# EAGLE schematic wireless_thermometer (EAGLE 9.3.2)
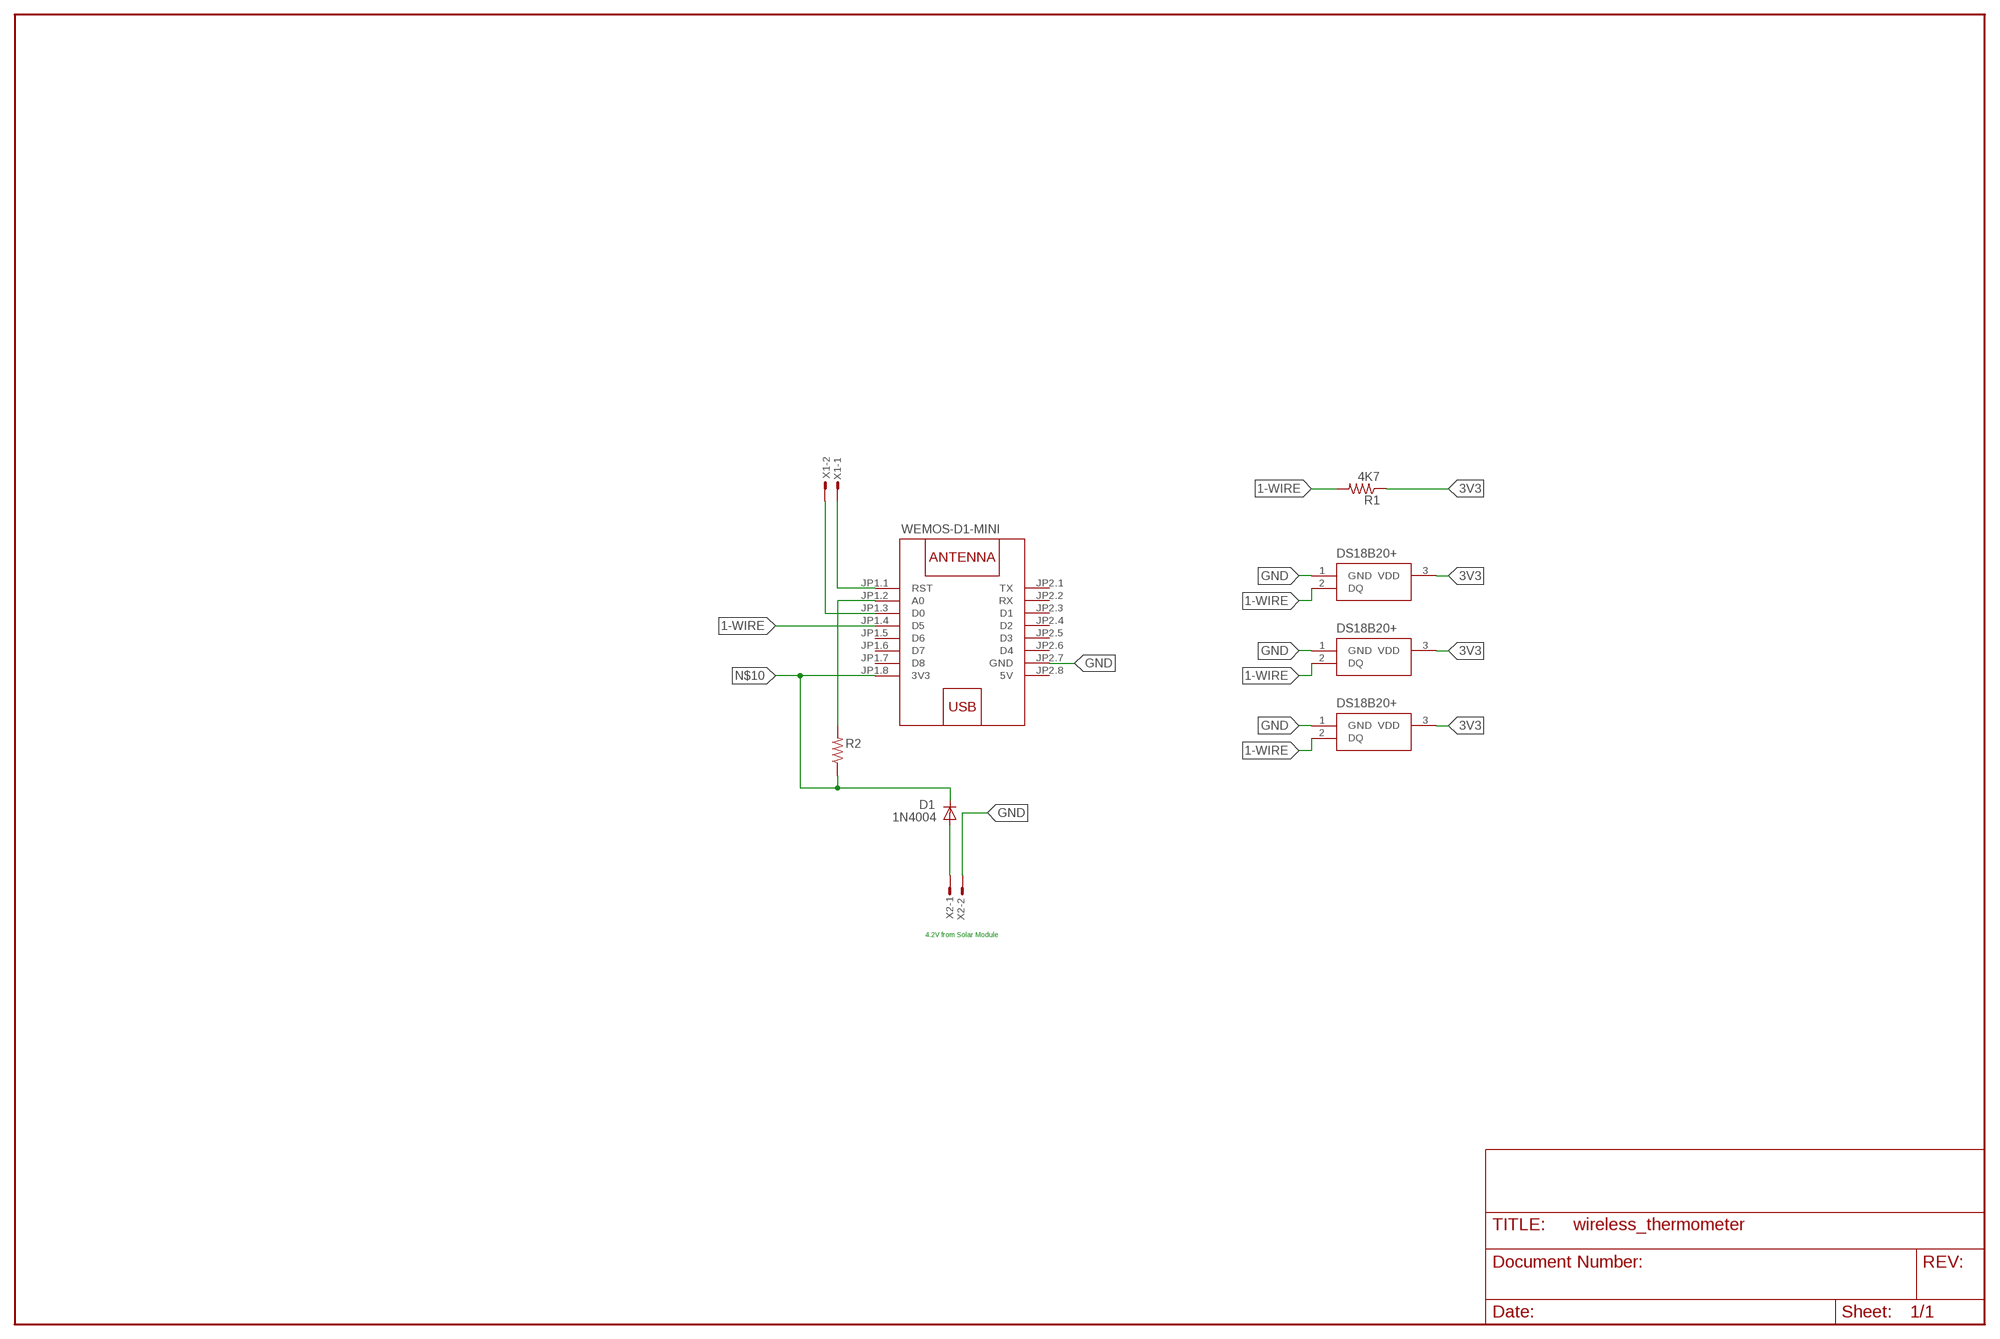
[diagram p0: schematic, sheet 1]

## Parts
D1  1N4004  [DO41-10]
IC1  DS18B20+  [TO-92]
IC2  DS18B20+  [TO-92]
IC3  DS18B20+  [TO-92]
R1  4K7  R-US_0207/10  [0207/10]
R2  R-US_0204/7  [0204/7]
W1  WEMOS-D1-MINI  [WEMOS-D1-MINI]
X1  C-GRID-02-70543  [70543-02]
X2  C-GRID-02-70543  [70543-02]

## Nets
1-WIRE: IC1.2(DQ) IC2.2(DQ) IC3.2(DQ)
3V3: IC1.3(VDD) IC2.3(VDD)
GND: IC1.1(GND) IC2.1(GND) IC3.1(GND) W1.JP2.7(GND)
N$1: W1.JP1.4(D5)
N$2: W1.JP1.3(D0) X1.2
N$3: W1.JP1.1(RST) X1.1
N$4: IC3.3(VDD)
N$5: D1.A X2.1
N$6: X2.2
N$7: R1.1
N$8: R1.2
N$9: R2.2 W1.JP1.2(A0)
N$10: D1.C R2.1 W1.JP1.8(3V3)
Unconnected: W1.JP1.5(D6) W1.JP1.6(D7) W1.JP1.7(D8) W1.JP2.1(TX) W1.JP2.2(RX) W1.JP2.3(D1) W1.JP2.4(D2) W1.JP2.5(D3) W1.JP2.6(D4)

## Notes on the sheet
- 4.2V from Solar Module

## Power pins joined to a net without a drawn wire
5V: W1.JP2.8(5V)

## Library data of the parts
D1 = adafruit:1N4004: DIODE General purpose 1N400x type rectifier (With bigger pads) http://www.ladyada.net/library/pcb/eaglelibrary.html
IC1-IC3 = SamacSys_Parts:DS18B20+: DS18B20 prog thermometer 1-Wire, TO92 Source: Datasheet <https://componentsearchengine.com/Datasheets/1/DS18B20 .pdf>; DESCRIPTION: DS18B20 prog thermometer 1-Wire, TO92; HEIGHT: mm; MANUFACTURER_NAME: Maxim Integrated; MANUFACTURER_PART_NUMBER: DS18B20+; MOUSER_PART_NUMBER: 700-DS18B20+; MOUSER_PRICE-STOCK: https://www.mouser.com/Search/Refine.aspx?Keyword=700-DS18B20%2B
R1 R2 = adafruit:R-US_: RESISTOR, American symbol
W1 = diy-modules:WEMOS-D1-MINI: WEMOS D1 mini: Mini Wi-Fi Board based on ESP-8266 device More details can be found here: https://www.wemos.cc/product/d1-mini.html Click here to find device on ebay.com <http://www.ebay.com/sch/wemos+d1+mini+nodemcu>
X1 X2 = con-molex:C-GRID-02: CONNECTOR wire to board 2.54 mm (0.100") pitch header; MF: MOLEX; OC_FARNELL: unknown; OC_NEWARK: unknown